# Altium schematic sheet SH9 - CAN.SchDoc: CAN
size B; CheckedBy: Lance Bantoto; Engineer: Cindy Li; Organization: UW Robotics; Address1: 200 University Avenue; Address2: Waterloo; Address3: Ontario; Address4: Canada N2L 3G6; DocumentNumber: 9; Revision: 2; SheetNumber: 9; SheetTotal: 10
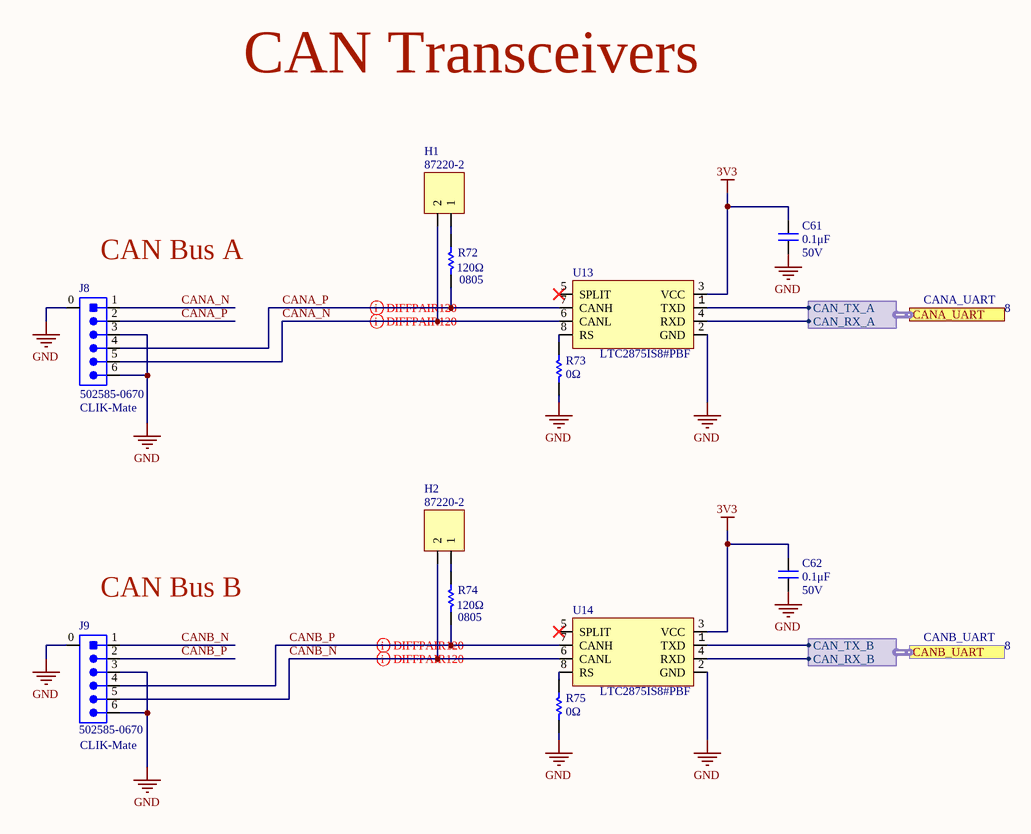
[diagram p0: SH9 - CAN.SchDoc]

## Parts
C61  value 0.1μF  Voltage Rating: 50V  [CAP2012]  (hidden comment: CAP_0.1uF_50V_0805)
C62  value 0.1μF  Voltage Rating: 50V  [CAP2012]  (hidden comment: CAP_0.1uF_50V_0805)
H1  Manufacturer Part Number 1: 87220-2  [HDR1X2]  (hidden comment: JUMPER_2)
H2  Manufacturer Part Number 1: 87220-2  [HDR1X2]  (hidden comment: JUMPER_2)
J8  Manufactor Number: 502585-0670  Family: CLIK-Mate  [MOLEX-5025850670]  (hidden comment: CON_6M_SM_RA_1.5mm)
J9  Manufactor Number: 502585-0670  Family: CLIK-Mate  [MOLEX-5025850670]  (hidden comment: CON_6M_SM_RA_1.5mm)
R72  Resistance: 120Ω  Package/Footprint: 0805  [RESC0805]  (hidden comment: RES_120Ω_0805_1%)
R73  value 0Ω  [RESC0805]  (hidden comment: RES_0Ω_0805)
R74  Resistance: 120Ω  Package/Footprint: 0805  [RESC0805]  (hidden comment: RES_120Ω_0805_1%)
R75  value 0Ω  [RESC0805]  (hidden comment: RES_0Ω_0805)
U13  Manufacturer Part Number 1: LTC2875IS8#PBF  [LT-S8_N]  (hidden comment: LTC2875)
U14  Manufacturer Part Number 1: LTC2875IS8#PBF  [LT-S8_N]  (hidden comment: LTC2875)

## Ports
CANA_UART (harness CANA_UART, see 8), CANB_UART (harness CANB_UART, see 8)

## Harnesses
CANA_UART: CAN_RX_A, CAN_TX_A
CANB_UART: CAN_RX_B, CAN_TX_B

## Nets
3V3: C61.1 C62.1 U13.3(VCC) U14.3(VCC)
GND: C61.2 C62.2 J8.0 J8.3 J8.6 J9.0 J9.3 J9.6 R73.1 R75.1 U13.2(GND) U14.2(GND)
CANA_N: H1.2 J8.1 J8.5 U13.6(CANL)
CANA_P: J8.2 J8.4 R72.1 U13.7(CANH)
CANB_N: H2.2 J9.1 J9.5 U14.6(CANL)
CANB_P: J9.2 J9.4 R74.1 U14.7(CANH)
NetH1_1: H1.1 R72.2
NetH2_1: H2.1 R74.2
NetR73_2: R73.2 U13.8(RS)
NetR75_2: R75.2 U14.8(RS)
NetU13_1: U13.1(TXD) ; port CANA_UART.CAN_TX_A
NetU13_4: U13.4(RXD) ; port CANA_UART.CAN_RX_A
NetU14_1: U14.1(TXD) ; port CANB_UART.CAN_TX_B
NetU14_4: U14.4(RXD) ; port CANB_UART.CAN_RX_B

Not connected (* = marked no-connect by the designer): U13 5(SPLIT)*; U14 5(SPLIT)*

## Layout directives
differential pair: CANA_N, CANA_P, CANB_N, CANB_P

## Notes on the sheet
- CAN Transceivers
- (near J8) CAN Bus A
- (near J9) CAN Bus B
- Title:
- Project:
- Date:
- Rev:
- Reviewer:
- Engineer:
- Sheet:
- of

## Library data of the parts
C61 C62 = CAP_0.1uF_50V_0805: CAP CER 0.1UF 50V X7R 0805; Manufacturer Part Number 1: GCM21BR71H104KA37K; Manufacturer 1: Murata Electronics; Tolerance: 10%; Package/Footprint: 0805; Supplier Part Number 1: 490-8049-1-ND; Supplier 1: Digi-Key; Mount: Surface Mount; Dielectric: X7R; Length: 2mm; Height: 1.25mm; Width: 0.049inch; Thickness: 0.049inch; Depth: 1.25mm; Ratings: AEC-Q200; LCSC Part #: C49678; Mounting Type: SMD
H1 H2 = JUMPER_2: HEADER 2X1; Manufacturer 1: TE Connectivity; Package/Footprint: TH; Supplier 1: Digi-Key; Supplier Part Number 1: A26542-ND; Mount: Through Hole; Mounting Type: TH
J8 J9 = CON_6M_SM_RA_1.5mm: CONN HEADER SMD RIGHT ANGLE 1.5 MM PITCH; Manufacturer: Molex; Supplier 1: Digi-Key; Supplier Part Number 1: WM12832CT-ND; Package/Footprint: SMD; Mounting Type: SMD
R72 R74 = RES_120Ω_0805_1%: RES 120 OHM 1% 1/8W 0805; Manufacturer 1: Vishay; Manufacturer Part Number 1: CRCW0805120RFKEA; Supplier Part Number 1: 541-120CCT-ND; Supplier 1: Digi-Key; LCSC Part #: C17437; Mounting Type: SMD
R73 R75 = RES_0Ω_0805: RES 0 OHM JUMPER 1/8W 0805; Manufacturer 1: Panasonic Electronic Components; Manufacturer Part Number 1: ERJ-6GEY0R00V; Package/Footprint: 0805; Supplier Part Number 1: P0.0ACT-ND; Supplier 1: Digi-Key; LCSC Part #: C17477; Mounting Type: SMD
U13 U14 = LTC2875: IC TXRX CAN 4MBPS 8SO; Manufacturer 1: Linear Technologies; Package/Footprint: 8-SOIC; Supplier Part Number 1: LTC2875IS8#PBF-ND; Supplier 1: Digi-Key; LCSC Part #: C117076; Mounting Type: SMD